# EAGLE schematic RasPiTimePowerSW_basic (EAGLE 7.7.0)
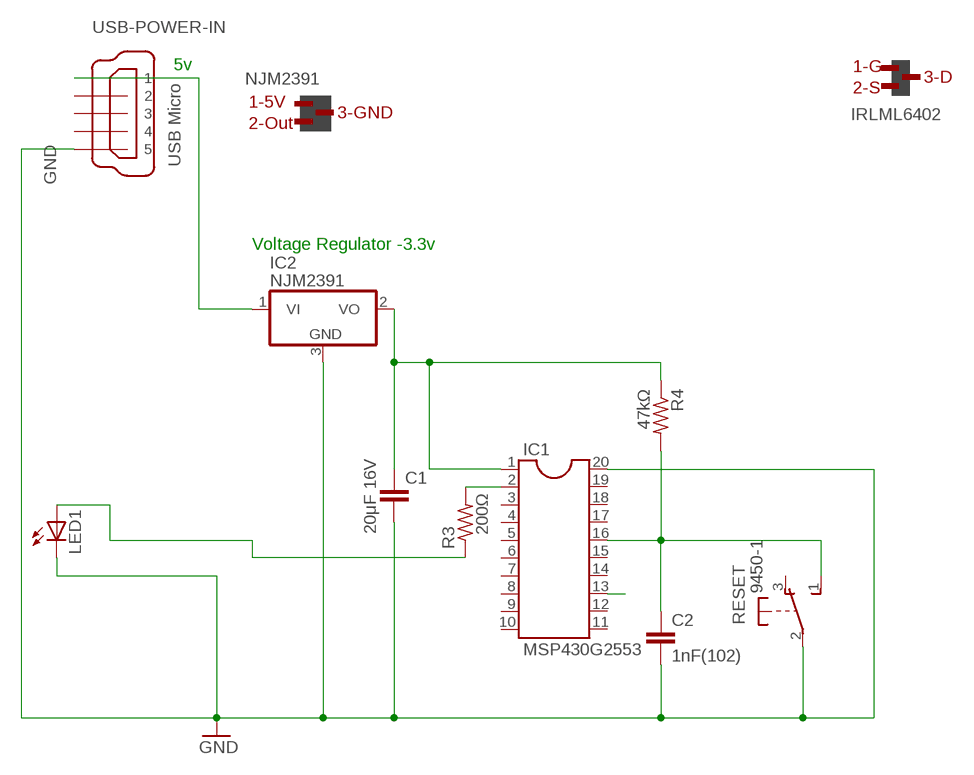
[diagram p0: schematic, sheet 1]

## Parts
C1  20μF 16V  C-EU075-042X103  [C075-042X103]
C2  1nF(102)  C-EU025-024X044  [C025-024X044]
IC1  MSP430G2553  DIL20S  [SOCKET-20]
IC2  NJM2391  7805DT  [TO252]
LED1  TLLG4400  [LED3MM]
R3  R-US_MELF0102W  [MINI_MELF-0102W]
R4  47kΩ  R-US_MELF0102W  [MINI_MELF-0102W]
RESET  9450-1  [9450-1]
USB-POWER-IN  USB Micro  MINI-USB_SHIELD5P4-32005-400  [32005-400]

## Nets
3.3V: C1.1 IC1.1 IC2.2(VO) R4.1
5VIN: IC2.1(VI) USB-POWER-IN.1
GND: C1.2 C2.2 IC1.20 IC2.3(GND) LED1.K(C) RESET.2(P) USB-POWER-IN.5
N$2: IC1.13
N$4: IC1.2 R3.2
N$7: LED1.A R3.1
RESET: C2.1 IC1.16 R4.2 RESET.1(S)
Unconnected: IC1.3 IC1.4 IC1.5 IC1.6 IC1.7 IC1.8 IC1.9 IC1.10 IC1.11 IC1.12 IC1.14 IC1.15 IC1.17 IC1.18 IC1.19 RESET.3(O) USB-POWER-IN.2 USB-POWER-IN.3 USB-POWER-IN.4 USB-POWER-IN.M1(S1) USB-POWER-IN.M2(S2) USB-POWER-IN.M3(S3) USB-POWER-IN.M4(S4)

## Notes on the sheet
- 5v | 1-G
- NJM2391 | 3-D
- 2-S
- 1-5V
- 3-GND | IRLML6402
- 2-Out
- Voltage Regulator -3.3v

## Library data of the parts
C1 C2 = resistor:C-EU: CAPACITOR, European symbol
IC1 = ic-package:DIL20: Dual In Line / Socket
IC2 = linear:78*: Positive VOLTAGE REGULATOR Source: http://cache.national.com/ds/LM/LM78L05.pdf http://www.fairchildsemi.com/ds/LM/LM7805.pdf
LED1 = led:TLLG4400: Low Current (2mA) LED 3 mm Tinted Diffused Package color GREEN Source: Data sheet <http://www.farnell.com/datasheets/391098.pdf>; MF: VISHAY SEMICONDUCTOR; OC_FARNELL: 1612435
R3 = resistor:R-US_: RESISTOR, American symbol; R: 200Ω
R4 = resistor:R-US_: RESISTOR, American symbol
RESET = switch-misc:9450-1: MARQUARDT SWITCH
USB-POWER-IN = con-cypressindustries:MINI-USB_SHIELD5P4-: MINI USB-B R/A W/O POST 5 pol. Source: www.cypressindustries.com; OC_FARNELL: unknown; OC_NEWARK: unknown